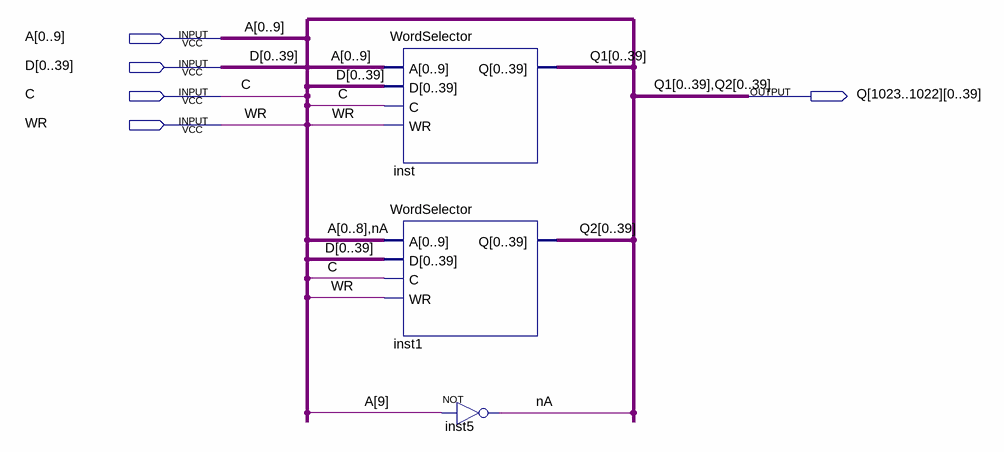
[diagram p0: schematic sheet]
// Quartus schematic Word2.bdf as structural Verilog: 3 symbols, 5 pins
module Word2 (
  input  [0:9] A,
  input  [0:39] D,
  input  C,
  input  WR,
  output [39:0] Q_1023,
  output [39:0] Q_1022
);

  wire nA;

  WordSelector inst (
    .A(A), .D(D), .C(C), .WR(WR),
    .Q({Q_1023[0], Q_1023[1], Q_1023[2], Q_1023[3], Q_1023[4], Q_1023[5], Q_1023[6], Q_1023[7], Q_1023[8], Q_1023[9], Q_1023[10], Q_1023[11], Q_1023[12], Q_1023[13], Q_1023[14], Q_1023[15], Q_1023[16], Q_1023[17], Q_1023[18], Q_1023[19], Q_1023[20], Q_1023[21], Q_1023[22], Q_1023[23], Q_1023[24], Q_1023[25], Q_1023[26], Q_1023[27], Q_1023[28], Q_1023[29], Q_1023[30], Q_1023[31], Q_1023[32], Q_1023[33], Q_1023[34], Q_1023[35], Q_1023[36], Q_1023[37], Q_1023[38], Q_1023[39]}));
  WordSelector inst1 (
    .A({A[0:8], nA}), .D(D), .C(C), .WR(WR),
    .Q({Q_1022[0], Q_1022[1], Q_1022[2], Q_1022[3], Q_1022[4], Q_1022[5], Q_1022[6], Q_1022[7], Q_1022[8], Q_1022[9], Q_1022[10], Q_1022[11], Q_1022[12], Q_1022[13], Q_1022[14], Q_1022[15], Q_1022[16], Q_1022[17], Q_1022[18], Q_1022[19], Q_1022[20], Q_1022[21], Q_1022[22], Q_1022[23], Q_1022[24], Q_1022[25], Q_1022[26], Q_1022[27], Q_1022[28], Q_1022[29], Q_1022[30], Q_1022[31], Q_1022[32], Q_1022[33], Q_1022[34], Q_1022[35], Q_1022[36], Q_1022[37], Q_1022[38], Q_1022[39]}));
  not inst5 (nA, A[9]);

  // Other names for the same wires on the sheet: Q1[39:0] = Q_1023; Q2[39:0] = Q_1022
endmodule
